# EAGLE design GrandBoard (EAGLE 6.4)
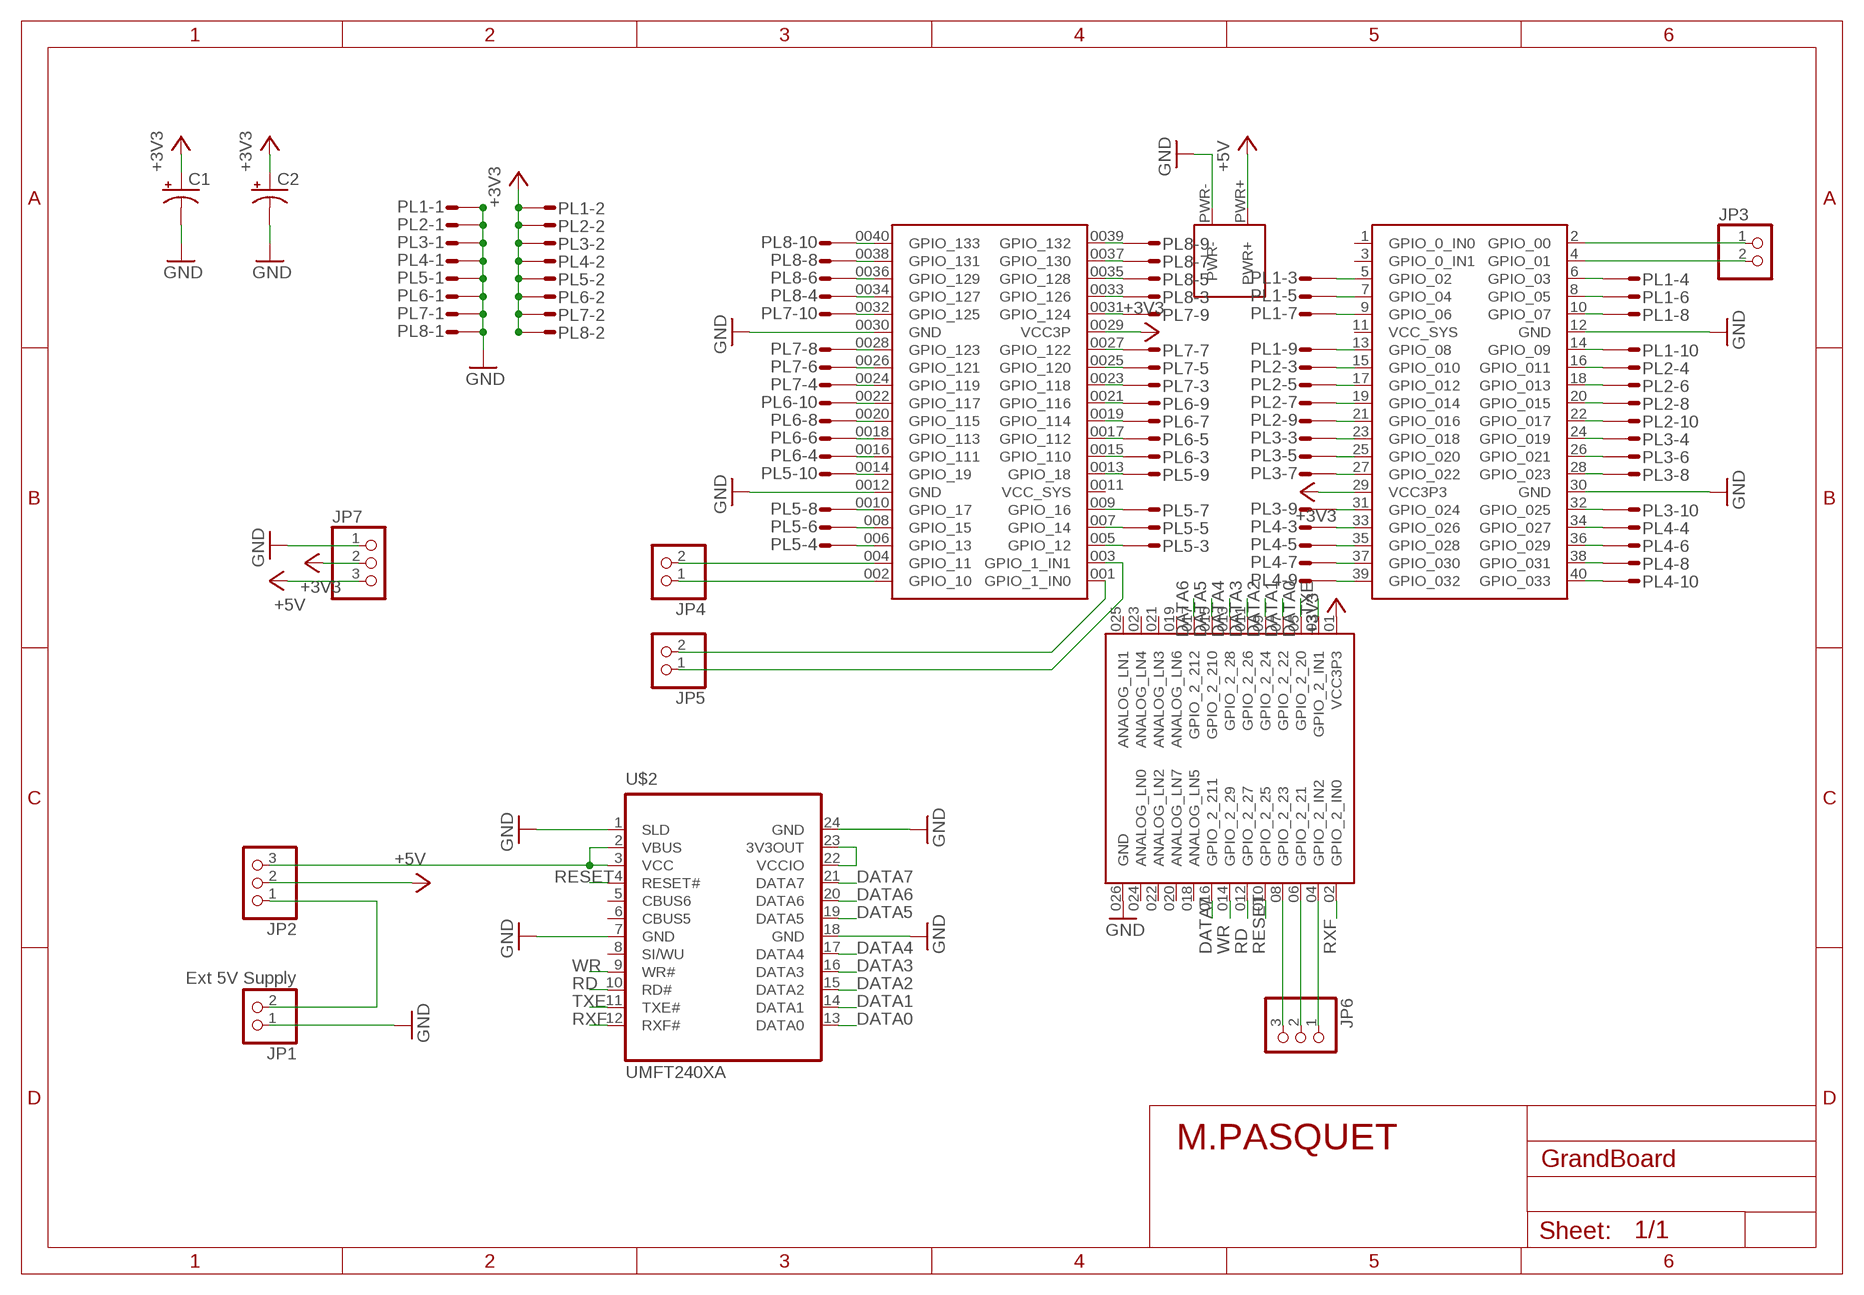
[diagram p0: schematic, sheet 1]

## Parts
C1  CAP_POLPTH2  [CPOL-RADIAL-10UF-25V]
C2  CAP_POLPTH2  [CPOL-RADIAL-10UF-25V]
JP1  Ext 5V Supply  PINHD-1X2  [1X02]
JP2  PINHD-1X3  [1X03]
JP3  PINHD-1X2  [1X02]
JP4  PINHD-1X2  [1X02]
JP5  PINHD-1X2  [1X02]
JP6  PINHD-1X3  [1X03]
JP7  PINHD-1X3  [1X03]
PL1  10HS  [10H]
PL2  10HS  [10H]
PL3  10HS  [10H]
PL4  10HS  [10H]
PL5  10HS  [10H]
PL6  10HS  [10H]
PL7  10HS  [10H]
PL8  10HS  [10H]
U$1  DE0-NANO  [DE0-NANO]
U$2  UMFT240XA  [UMFT240XA]

## Nets
+3V3: C1.1(+) C2.1(+) JP7.2 PL1.2 PL2.2 PL3.2 PL4.2 PL5.2 PL6.2 PL7.2 PL8.2 U$1.01(VCC3P3) U$1.29(VCC3P3) U$1.0029(VCC3P)
+5V: JP2.2 JP7.3 U$1.PWR+
DATA0: U$1.05(GPIO_2_20) U$2.13(DATA0)
DATA1: U$1.07(GPIO_2_22) U$2.14(DATA1)
DATA2: U$1.09(GPIO_2_24) U$2.15(DATA2)
DATA3: U$1.011(GPIO_2_26) U$2.16(DATA3)
DATA4: U$1.013(GPIO_2_28) U$2.17(DATA4)
DATA5: U$1.015(GPIO_2_210) U$2.19(DATA5)
DATA6: U$1.017(GPIO_2_212) U$2.20(DATA6)
DATA7: U$1.016(GPIO_2_211) U$2.21(DATA7)
GND: C1.2(-) C2.2(-) JP1.1 JP7.1 PL1.1 PL2.1 PL3.1 PL4.1 PL5.1 PL6.1 PL7.1 PL8.1 U$1.0012(GND) U$1.12(GND) U$1.026(GND) U$1.30(GND) U$1.0030(GND) U$1.PWR- U$2.1(SLD) U$2.7(GND) U$2.18(GND) U$2.24(GND)
N$1: PL1.3 U$1.5(GPIO_02)
N$2: PL1.4 U$1.6(GPIO_03)
N$3: PL1.5 U$1.7(GPIO_04)
N$4: PL1.6 U$1.8(GPIO_05)
N$5: PL1.7 U$1.9(GPIO_06)
N$6: PL1.8 U$1.10(GPIO_07)
N$7: PL1.9 U$1.13(GPIO_08)
N$8: PL1.10 U$1.14(GPIO_09)
N$9: PL2.3 U$1.15(GPIO_010)
N$10: PL2.4 U$1.16(GPIO_011)
N$11: PL2.5 U$1.17(GPIO_012)
N$12: PL2.6 U$1.18(GPIO_013)
N$13: PL2.7 U$1.19(GPIO_014)
N$14: PL2.8 U$1.20(GPIO_015)
N$15: PL2.9 U$1.21(GPIO_016)
N$16: PL2.10 U$1.22(GPIO_017)
N$17: PL3.3 U$1.23(GPIO_018)
N$18: PL3.4 U$1.24(GPIO_019)
N$19: PL3.5 U$1.25(GPIO_020)
N$20: PL3.6 U$1.26(GPIO_021)
N$21: PL3.7 U$1.27(GPIO_022)
N$22: PL3.8 U$1.28(GPIO_023)
N$23: PL3.9 U$1.31(GPIO_024)
N$24: PL3.10 U$1.32(GPIO_025)
N$25: PL4.3 U$1.33(GPIO_026)
N$26: PL4.4 U$1.34(GPIO_027)
N$27: PL4.6 U$1.36(GPIO_029)
N$28: PL4.5 U$1.35(GPIO_028)
N$29: PL4.7 U$1.37(GPIO_030)
N$30: PL4.8 U$1.38(GPIO_031)
N$31: PL4.9 U$1.39(GPIO_032)
N$32: PL4.10 U$1.40(GPIO_033)
N$33: PL5.3 U$1.005(GPIO_12)
N$34: PL5.4 U$1.006(GPIO_13)
N$35: PL5.5 U$1.007(GPIO_14)
N$36: PL5.6 U$1.008(GPIO_15)
N$37: PL5.7 U$1.009(GPIO_16)
N$38: PL5.8 U$1.0010(GPIO_17)
N$39: PL5.9 U$1.0013(GPIO_18)
N$40: PL5.10 U$1.0014(GPIO_19)
N$41: PL6.3 U$1.0015(GPIO_110)
N$42: PL6.4 U$1.0016(GPIO_111)
N$43: PL6.5 U$1.0017(GPIO_112)
N$44: PL6.6 U$1.0018(GPIO_113)
N$45: PL6.7 U$1.0019(GPIO_114)
N$46: PL6.8 U$1.0020(GPIO_115)
N$47: PL6.9 U$1.0021(GPIO_116)
N$48: PL6.10 U$1.0022(GPIO_117)
N$49: PL7.3 U$1.0023(GPIO_118)
N$50: PL7.4 U$1.0024(GPIO_119)
N$51: PL7.5 U$1.0025(GPIO_120)
N$52: PL7.6 U$1.0026(GPIO_121)
N$53: PL7.7 U$1.0027(GPIO_122)
N$54: PL7.8 U$1.0028(GPIO_123)
N$55: PL7.9 U$1.0031(GPIO_124)
N$56: PL7.10 U$1.0032(GPIO_125)
N$57: PL8.3 U$1.0033(GPIO_126)
N$58: PL8.4 U$1.0034(GPIO_127)
N$59: PL8.5 U$1.0035(GPIO_128)
N$60: PL8.6 U$1.0036(GPIO_129)
N$61: PL8.7 U$1.0037(GPIO_130)
N$62: PL8.8 U$1.0038(GPIO_131)
N$63: PL8.9 U$1.0039(GPIO_132)
N$64: PL8.10 U$1.0040(GPIO_133)
N$65: U$2.22(VCCIO) U$2.23(3V3OUT)
N$66: JP2.3 U$2.2(VBUS) U$2.3(VCC)
N$67: JP1.2 JP2.1
N$68: JP3.1 U$1.2(GPIO_00)
N$69: JP3.2 U$1.4(GPIO_01)
N$70: JP4.1 U$1.002(GPIO_10)
N$71: JP4.2 U$1.004(GPIO_11)
N$72: JP5.1 U$1.003(GPIO_1_IN1)
N$73: JP5.2 U$1.001(GPIO_1_IN0)
N$74: JP6.1 U$1.04(GPIO_2_IN2)
N$75: JP6.2 U$1.06(GPIO_2_21)
N$76: JP6.3 U$1.08(GPIO_2_23)
RD: U$1.012(GPIO_2_27) U$2.10(RD#)
RESET: U$1.010(GPIO_2_25) U$2.4(RESET#)
RXF: U$1.02(GPIO_2_IN0) U$2.12(RXF#)
TXE: U$1.03(GPIO_2_IN1) U$2.11(TXE#)
WR: U$1.014(GPIO_2_29) U$2.9(WR#)
Unconnected: U$1.1(GPIO_0_IN0) U$1.3(GPIO_0_IN1) U$1.0011(VCC_SYS) U$1.11(VCC_SYS) U$1.018(ANALOG_LN5) U$1.019(ANALOG_LN6) U$1.020(ANALOG_LN7) U$1.021(ANALOG_LN3) U$1.022(ANALOG_LN2) U$1.023(ANALOG_LN4) U$1.024(ANALOG_LN0) U$1.025(ANALOG_LN1) U$2.5(CBUS6) U$2.6(CBUS5) U$2.8(SI/WU)

## Notes on the sheet
- M.PASQUET

## Library data of the parts
C1 C2 = SparkFun-Passives:CAP_POL: Capacitor Polarized These are standard SMD and PTH capacitors. Normally 10uF, 47uF, and 100uF in electrolytic and tantalum varieties. Always verify the external diameter of the through hole cap, it varies with capacity, voltage, and manufacturer. The EIA devices should be standard.
JP1 JP3-JP5 = pinhead:PINHD-1X2: PIN HEADER
JP2 JP6 JP7 = pinhead:PINHD-1X3: PIN HEADER
PL1-PL8 = con-harting-h:10HS: CONNECTOR; OC_FARNELL: unknown; OC_NEWARK: unknown
U$1 = DE0-NANO:DE0-NANO
U$2 = DE0-NANO:UMFT240XA

## Board
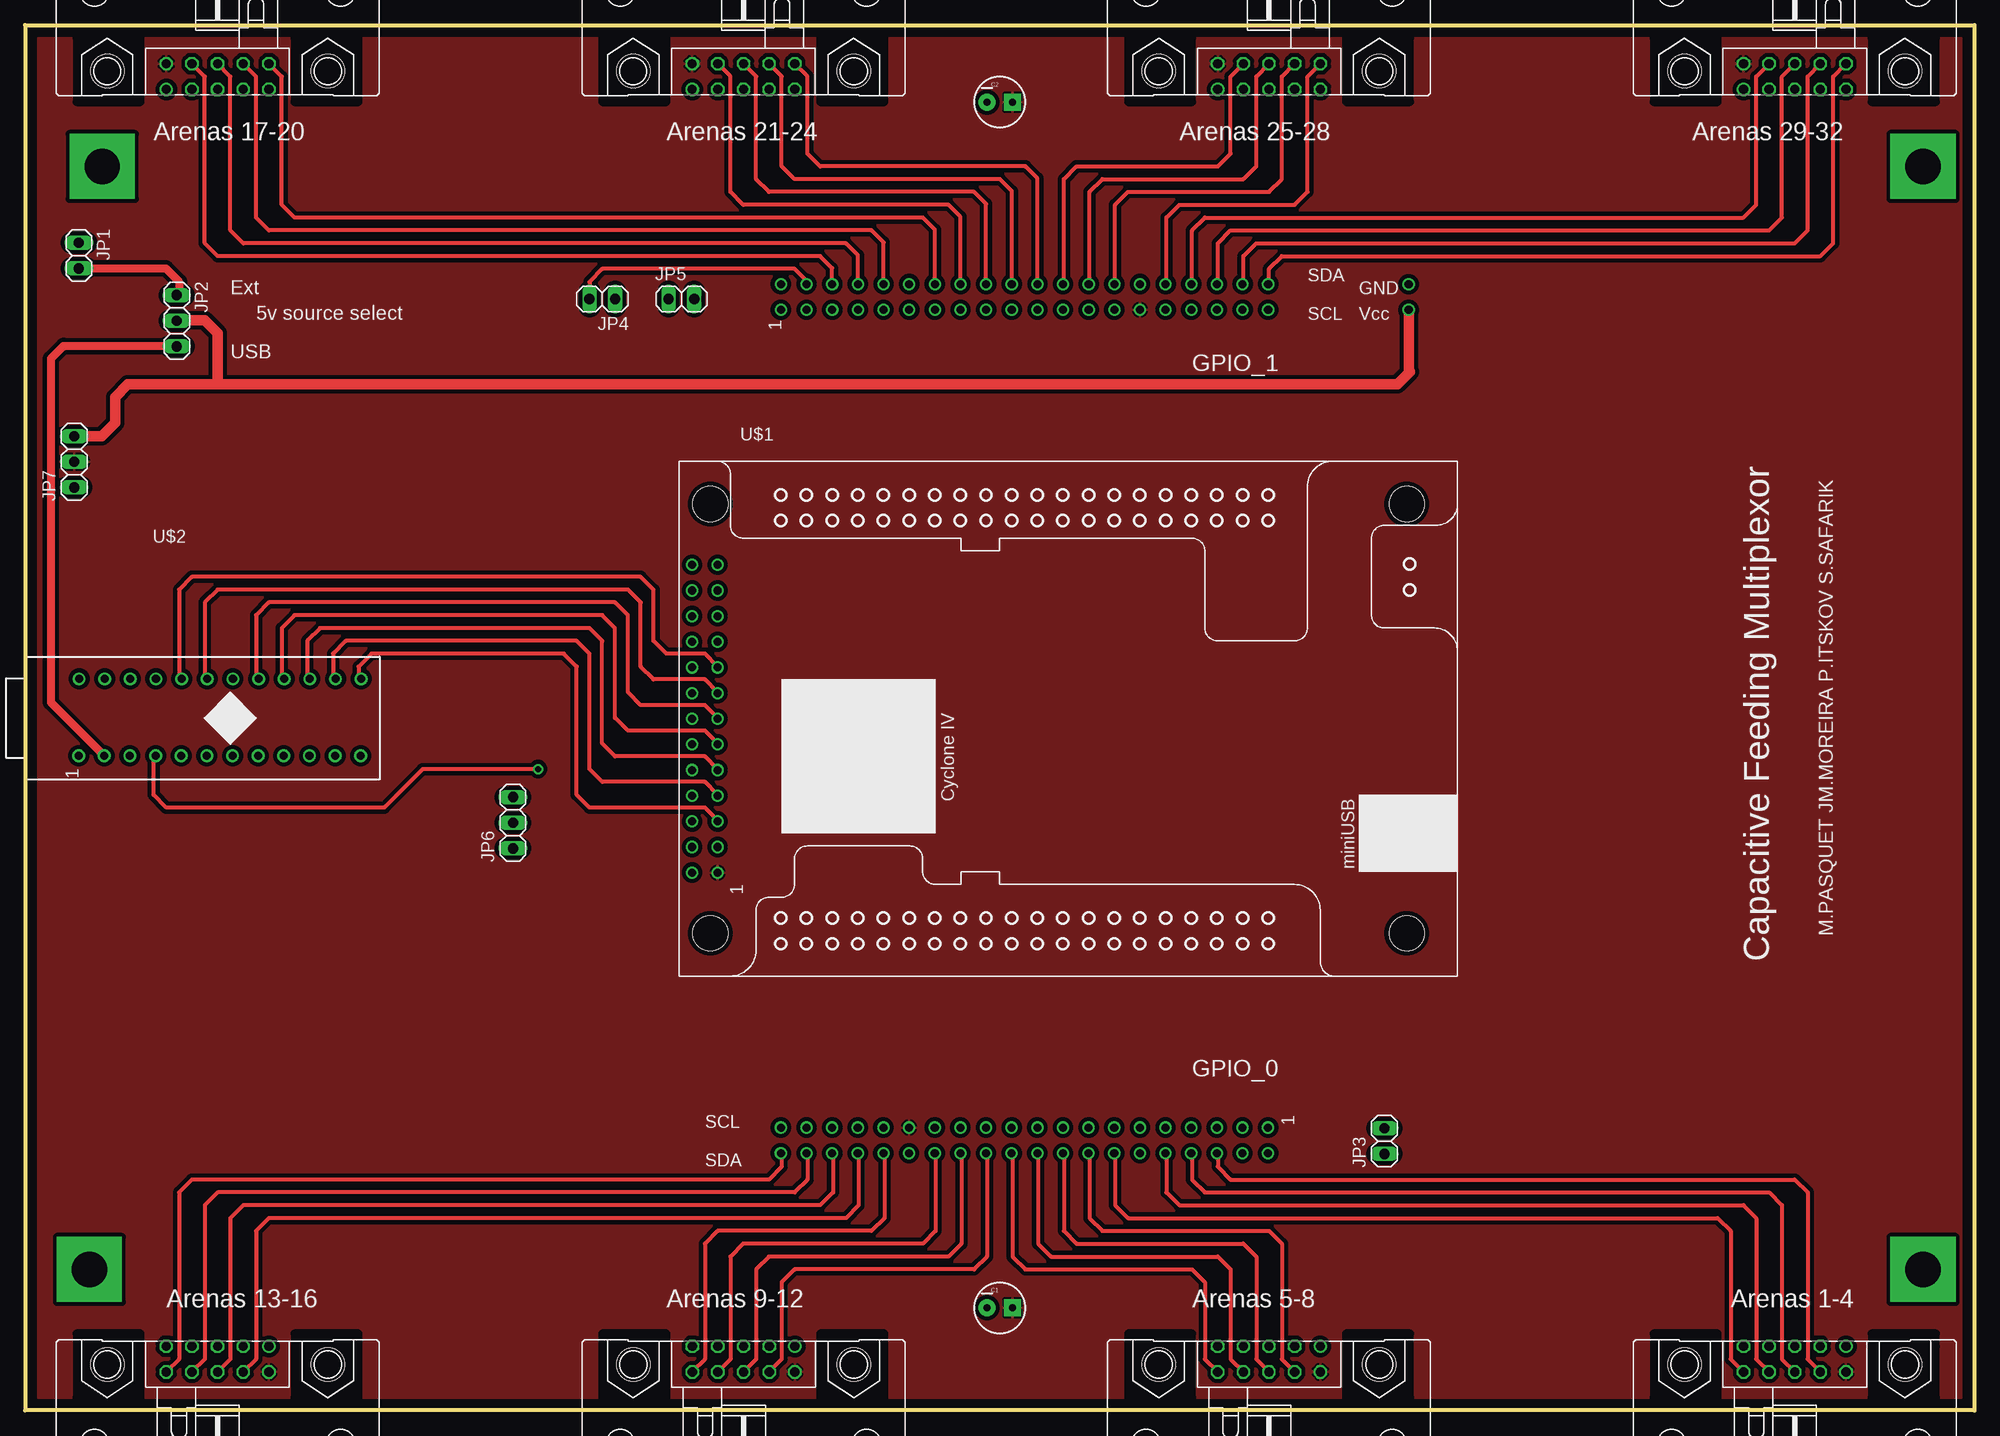
[diagram p1: board, top side]
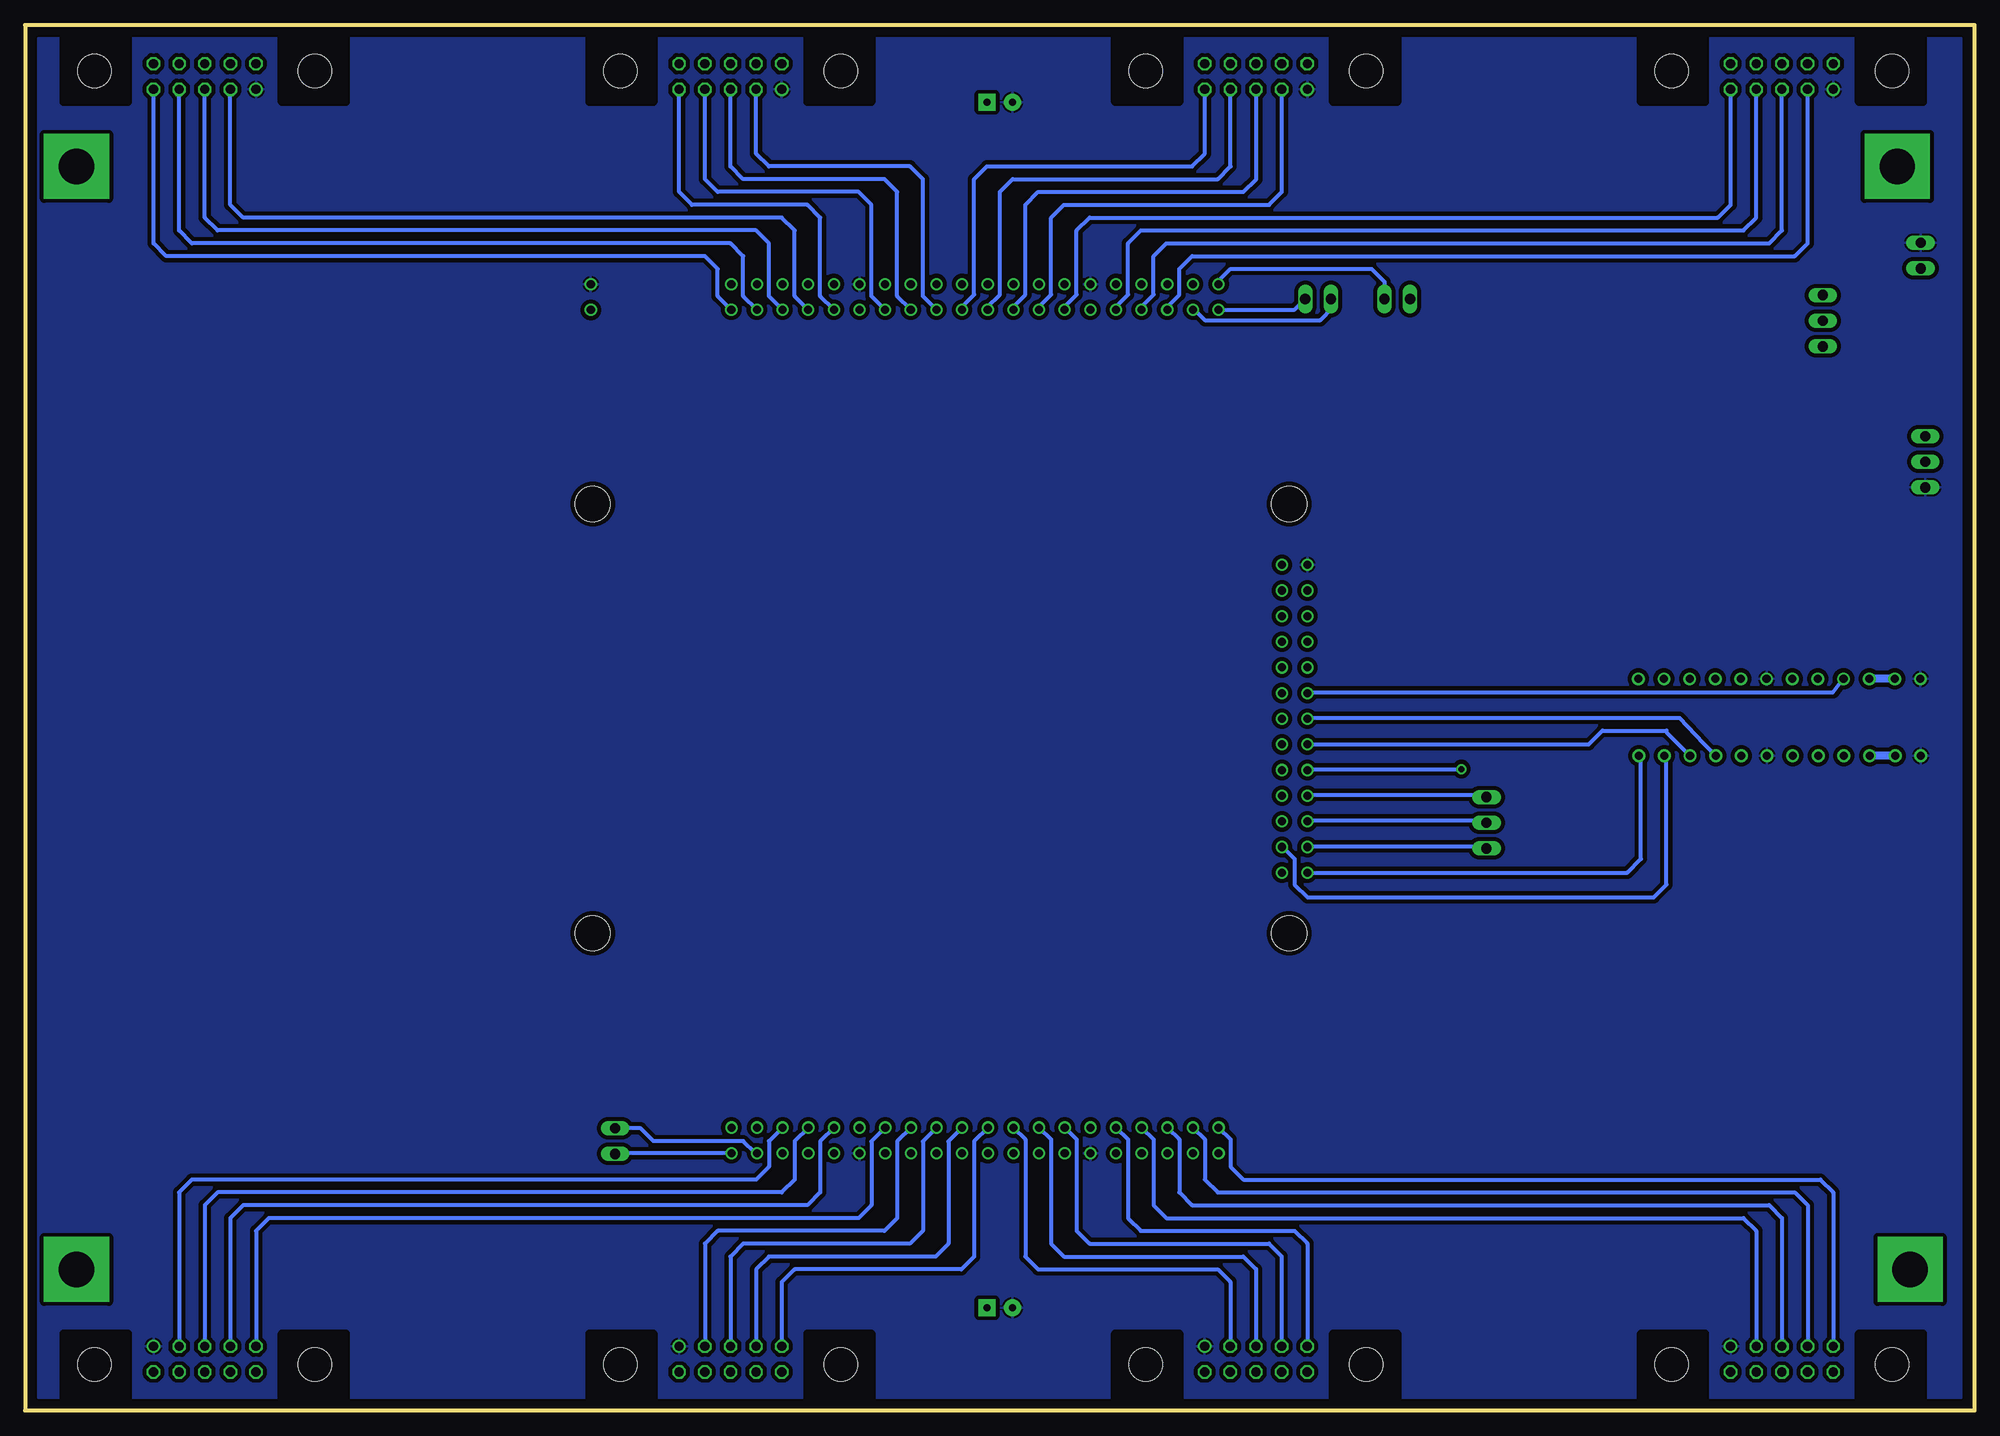
[diagram p2: board, bottom side, seen from below]

Size 193.04 x 137.16 mm. Coordinates in mm from the lower left corner, seen from the top.
Outline: 0,137.16 0,0 193.04,0 193.04,137.16 0,137.16
Copper layers (1*16): Top 0.018mm / dielectric 1.55mm / Bottom 0.018mm
Design rules "default": minimum track width 0.15mm, minimum drill 0.25mm, track to track 0.15mm, track to pad 0.15mm, pad to pad 0.15mm, via to via 0.15mm, smd to smd 0.15mm, copper to edge 0.45mm, drill to drill 0.3mm, minimum pad ring 0.2mm, minimum via ring 0.2mm, stop-mask expansion 0.1mm, vias tented up to drill 0mil, thermal gap 0.2mm
tRestrict: area 5.1,129.5 to 11.4,135.9; area 26.7,129.5 to 33,135.9; area 57.2,129.5 to 63.5,135.9; area 78.7,129.5 to 85.1,135.9; area 109.2,129.5 to 115.6,135.9; area 130.8,129.5 to 137.2,135.9; area 161.3,129.5 to 167.6,135.9; area 182.9,129.5 to 189.2,135.9; area 182.9,1.3 to 189.2,6.3; area 182.9,6.3 to 189.2,7.6; area 130.8,1.3 to 137.2,7.6; area 109.2,1.3 to 115.6,7.6; 5 more areas
bRestrict: area 5.1,1.3 to 11.4,7.6; area 26.7,1.3 to 33,7.6; area 57.2,1.3 to 63.5,7.6; area 78.7,1.3 to 85.1,7.6; area 109.2,1.3 to 115.6,7.6; area 130.8,1.3 to 137.2,7.6; area 161.3,1.3 to 167.6,7.6; area 182.9,1.3 to 189.2,7.6; area 109.2,129.5 to 115.6,135.9; area 130.8,129.5 to 137.2,135.9; area 161.3,129.5 to 167.6,135.9; area 182.9,129.5 to 189.2,135.9; 4 more areas

### Footprints (pad centres in the part's own frame; a part is rotated, then mirrored left to right if it is on the bottom)
CPOL-RADIAL-10UF-25V = drill 0.7 pad 1.651 square: 1 1.27,0 | drill 0.7 pad 1.651: 2 -1.27,0
1X02 = drill 1.016 long: 1 -1.27,0; 2 1.27,0
1X03 = drill 1.016 long: 1 -2.54,0; 2 0,0; 3 2.54,0
10H = drill 0.914: 1 -5.08,-1.27 | drill 0.914 octagon: 2 -5.08,1.27; 3 -2.54,-1.27; 4 -2.54,1.27; 5 0,-1.27; 6 0,1.27; 7 2.54,-1.27; 8 2.54,1.27; 9 5.08,-1.27; 10 5.08,1.27 | hole 3.302: -10.922,0.533; 10.922,0.533
DE0-NANO = drill 0.8: 01 40.73,3.81; 001 -15.01,10.08; 1 65.97,58.33; 02 40.73,1.27; 002 -17.55,10.08; 2 68.51,58.33; 03 38.19,3.81; 003 -15.01,12.62; 3 65.97,55.79; 04 38.19,1.27; 004 -17.55,12.62; 4 68.51,55.79; 05 35.65,3.81; 005 -15.01,15.16; 5 65.97,53.25; 06 35.65,1.27; 006 -17.55,15.16; 6 68.51,53.25; 07 33.11,3.81; 007 -15.01,17.7; 7 65.97,50.71; 08 33.11,1.27; 008 -17.55,17.7; 8 68.51,50.71; 09 30.57,3.81; 009 -15.01,20.24; 9 65.97,48.17; 010 30.57,1.27; 0010 -17.55,20.24; 10 68.51,48.17; 011 28.03,3.81; 0011 -15.01,22.78; 11 65.97,45.63; 012 28.03,1.27; 0012 -17.55,22.78; 12 68.51,45.63; 013 25.49,3.81; 0013 -15.01,25.32; 13 65.97,43.09; 014 25.49,1.27; 0014 -17.55,25.32; 14 68.51,43.09; 015 22.95,3.81; 0015 -15.01,27.86; 15 65.97,40.55; 016 22.95,1.27; 0016 -17.55,27.86; 16 68.51,40.55; 017 20.41,3.81; 0017 -15.01,30.4; 17 65.97,38.01; 018 20.41,1.27; 0018 -17.55,30.4; 18 68.51,38.01; 019 17.87,3.81; 0019 -15.01,32.94; 19 65.97,35.47; 020 17.87,1.27; 0020 -17.55,32.94; 20 68.51,35.47; 021 15.33,3.81; 0021 -15.01,35.48; 21 65.97,32.93; 022 15.33,1.27; 0022 -17.55,35.48; 22 68.51,32.93; 023 12.79,3.81; 0023 -15.01,38.02; 23 65.97,30.39; 024 12.79,1.27; 0024 -17.55,38.02; 24 68.51,30.39; 025 10.25,3.81; 0025 -15.01,40.56; 25 65.97,27.85; 026 10.25,1.27; 0026 -17.55,40.56; 26 68.51,27.85; 0027 -15.01,43.1; 27 65.97,25.31; 0028 -17.55,43.1; 28 68.51,25.31; 0029 -15.01,45.64; 29 65.97,22.77; 0030 -17.55,45.64; 30 68.51,22.77; 0031 -15.01,48.18; 31 65.97,20.23; 0032 -17.55,48.18; 32 68.51,20.23; 0033 -15.01,50.72; 33 65.97,17.69; 0034 -17.55,50.72; 34 68.51,17.69; 0035 -15.01,53.26; 35 65.97,15.15; 0036 -17.55,53.26; 36 68.51,15.15; 0037 -15.01,55.8; 37 65.97,12.61; 0038 -17.55,55.8; 38 68.51,12.61; 0039 -15.01,58.34; 39 65.97,10.07; 0040 -17.55,58.34; 40 68.51,10.07; PWR+ -15,72.25; PWR- -17.54,72.25 | hole 3.5: 46.73,3.07; 4.23,3.07; 4.23,72.07; 46.73,72.07
UMFT240XA = drill 0.8 pad 1.27: 1 7.611,-0.02; 2 7.611,2.52; 3 7.611,5.06; 4 7.611,7.6; 5 7.611,10.14; 6 7.611,12.68; 7 7.611,15.22; 8 7.611,17.76; 9 7.611,20.3; 10 7.611,22.84; 11 7.611,25.38; 12 7.611,27.92; 13 0.01,27.96; 14 0.01,25.42; 15 0.01,22.88; 16 0.01,20.34; 17 0.01,17.8; 18 0.01,15.26; 19 0.01,12.72; 20 0.01,10.18; 21 0.01,7.64; 22 0.01,5.1; 23 0.01,2.56; 24 0.01,0.02

### Placement (x,y rotation side)
C1  96.52,10.16 0 top
C2  96.52,129.54 0 top
JP1  5.31,114.35 270 top
JP2  15.01,107.9 270 top
JP3  134.62,26.67 90 top
JP4  57.15,110.05 180 top
JP5  65,110.05 0 top
JP6  48.31,58.19 90 top
JP7  4.85,93.93 90 top
PL1  175.26,5.08 180 top
PL2  123.19,5.08 180 top
PL3  71.15,5.08 180 top
PL4  19.05,5.08 180 top
PL5  19.05,132.08 0 top
PL6  71.14,132.08 0 top
PL7  123.19,132.08 0 top
PL8  175.26,132.08 0 top
U$1  64.77,93.98 270 top
U$2  5.31,72.44 270 top

### Tracks (layer width: path | path; a pad name or v marks a point on that pad's centre or on a via)
+3V3
  pour Top (isolate 0.406): 1.27,135.89 191.77,135.89 191.77,1.27 1.27,1.27
+5V
  Top 1.016: JP7.3 7.57,96.47 8.89,97.79 8.89,100.33 10.16,101.6 19.05,101.6 | 19.05,101.6 19.05,106.68 17.78,107.95 15.06,107.95 JP2.2 | U$1.PWR+ 137.02,103.01 137.16,102.87 135.89,101.6 19.05,101.6
DATA0
  Top 0.406: U$1.05 68.58,58.42 67.31,59.69 55.88,59.69 54.61,60.96 54.61,73.66 53.34,74.93 34.29,74.93 33.02,73.66 33.02,72.68 U$2.13
DATA1
  Top 0.406: U$1.07 68.58,60.96 67.31,62.23 57.15,62.23 55.88,63.5 55.88,74.93 54.61,76.2 31.75,76.2 30.48,74.93 30.48,72.68 U$2.14
DATA2
  Top 0.406: U$1.09 68.58,63.5 67.31,64.77 58.42,64.77 57.15,66.04 57.15,76.2 55.88,77.47 29.21,77.47 27.94,76.2 27.94,72.68 U$2.15
DATA3
  Top 0.406: U$1.011 68.58,66.04 67.31,67.31 59.69,67.31 58.42,68.58 58.42,77.47 57.15,78.74 26.67,78.74 25.4,77.47 25.4,72.68 U$2.16
DATA4
  Top 0.406: U$1.013 68.58,68.58 67.31,69.85 60.96,69.85 59.69,71.12 59.69,78.74 58.42,80.01 24.13,80.01 22.86,78.74 22.86,72.68 U$2.17
DATA5
  Top 0.406: U$1.015 68.58,71.12 67.31,72.39 62.23,72.39 60.96,73.66 60.96,80.01 59.69,81.28 19.05,81.28 17.78,80.01 17.78,72.68 U$2.19
DATA6
  Top 0.406: U$1.017 68.58,73.66 67.31,74.93 63.5,74.93 62.23,76.2 62.23,81.28 60.96,82.55 16.51,82.55 15.24,81.28 15.24,72.68 U$2.20
DATA7
  Bottom 0.406: U$1.016 66.04,71.12 13.97,71.12 U$2.21
GND
  pour Bottom (isolate 0.406): 1.27,135.89 191.77,135.89 191.77,1.27 1.27,1.27
N$1
  Bottom 0.406: U$1.5 119.36,26.67 119.38,26.67 119.38,24.13 120.65,22.86 176.53,22.86 177.8,21.59 PL1.3
N$2
  Top 0.406: U$1.6 118.11,25.38 118.11,24.13 119.38,22.86 175.26,22.86 176.53,21.59 176.53,5.08 PL1.4
N$3
  Bottom 0.406: U$1.7 116.82,26.67 116.84,26.67 116.84,22.86 118.11,21.59 173.99,21.59 175.26,20.32 PL1.5
N$4
  Top 0.406: U$1.8 115.57,25.38 115.57,22.86 116.84,21.59 172.72,21.59 173.99,20.32 173.99,5.08 PL1.6
N$5
  Bottom 0.406: U$1.9 114.3,26.65 114.3,21.59 115.57,20.32 171.45,20.32 172.72,19.05 PL1.7
N$6
  Top 0.406: U$1.10 113.03,25.38 113.03,21.59 114.3,20.32 170.18,20.32 171.45,19.05 171.45,5.08 PL1.8
N$7
  Bottom 0.406: PL1.9 170.18,17.78 168.91,19.05 110.49,19.05 109.22,20.32 109.22,26.65 U$1.13
N$8
  Top 0.406: U$1.14 107.95,25.38 107.95,20.32 109.22,19.05 167.64,19.05 168.91,17.78 168.91,5.08 PL1.10
N$9
  Bottom 0.406: U$1.15 106.68,26.65 106.68,19.05 107.95,17.78 124.46,17.78 125.73,16.51 PL2.3
N$10
  Top 0.406: U$1.16 105.41,25.38 105.41,19.05 106.68,17.78 123.19,17.78 124.46,16.51 124.46,5.08 PL2.4
N$11
  Bottom 0.406: U$1.17 104.14,26.65 104.14,17.78 105.41,16.51 121.92,16.51 123.19,15.24 PL2.5
N$12
  Top 0.406: U$1.18 102.87,25.38 102.87,17.78 104.14,16.51 120.65,16.51 121.92,15.24 121.92,5.08 PL2.6
N$13
  Bottom 0.406: U$1.19 101.6,26.65 101.6,16.51 102.87,15.24 119.38,15.24 120.65,13.97 PL2.7
N$14
  Top 0.406: U$1.20 100.33,25.38 100.33,16.51 101.6,15.24 118.11,15.24 119.38,13.97 119.38,5.08 PL2.8
N$15
  Bottom 0.406: U$1.21 99.06,26.65 99.06,15.24 100.33,13.97 116.84,13.97 118.11,12.7 PL2.9
N$16
  Top 0.406: U$1.22 97.79,25.38 97.79,15.24 99.06,13.97 115.57,13.97 116.84,12.7 116.84,5.08 PL2.10
N$17
  Bottom 0.406: U$1.23 93.98,26.83 93.98,15.24 92.71,13.97 74.93,13.97 73.69,12.72 PL3.3
N$18
  Top 0.406: U$1.24 95.25,25.38 95.25,15.24 93.98,13.97 76.2,13.97 74.93,12.7 74.93,5.08 73.69,3.83 PL3.4
N$19
  Bottom 0.406: U$1.25 91.44,26.83 91.44,16.51 90.17,15.24 72.39,15.24 71.14,13.99 PL3.5
N$20
  Top 0.406: U$1.26 92.71,25.38 92.71,16.51 91.44,15.24 73.66,15.24 72.39,13.97 72.39,5.08 71.14,3.83 PL3.6
N$21
  Bottom 0.406: U$1.27 88.9,26.83 88.9,17.78 87.63,16.51 69.85,16.51 68.61,15.27 PL3.7
N$22
  Top 0.406: U$1.28 90.17,25.38 90.17,17.78 88.9,16.51 71.12,16.51 69.85,15.24 69.85,5.08 68.61,3.83 PL3.8
N$23
  Bottom 0.406: U$1.31 83.82,26.83 83.82,19.05 82.55,17.78 67.31,17.78 66.06,16.54 PL3.9
N$24
  Top 0.406: U$1.32 85.09,25.38 85.09,19.05 83.82,17.78 68.58,17.78 67.31,16.51 67.31,5.08 66.06,3.83 PL3.10
N$25
  Bottom 0.406: U$1.33 81.28,26.83 81.28,20.32 80.01,19.05 22.86,19.05 21.59,17.78 PL4.3
N$26
  Top 0.406: U$1.34 82.55,25.38 82.55,20.32 81.28,19.05 24.13,19.05 22.86,17.78 22.86,5.08 PL4.4
N$27
  Top 0.406: U$1.36 80.01,25.38 80.01,21.59 78.74,20.32 21.59,20.32 20.32,19.05 20.32,5.08 PL4.6
N$28
  Bottom 0.406: U$1.35 78.74,26.83 78.74,21.59 77.47,20.32 20.32,20.32 19.05,19.05 PL4.5
N$29
  Bottom 0.406: U$1.37 76.2,26.83 76.2,22.86 74.93,21.59 17.78,21.59 16.51,20.32 PL4.7
N$30
  Top 0.406: U$1.38 77.47,25.38 77.47,22.86 76.2,21.59 19.05,21.59 17.78,20.32 17.78,5.08 PL4.8
N$31
  Bottom 0.406: U$1.39 73.66,26.83 73.66,24.13 72.39,22.86 15.24,22.86 13.97,21.59 PL4.9
N$32
  Top 0.406: U$1.40 74.93,25.38 74.93,24.13 73.66,22.86 16.51,22.86 15.24,21.59 15.24,5.08 PL4.10
N$33
  Bottom 0.406: U$1.005 79.93,109.3 78.74,110.49 78.74,113.03 77.47,114.3 17.78,114.3 16.51,115.57 PL5.3
N$34
  Top 0.406: U$1.006 79.93,113.11 78.74,114.3 19.05,114.3 17.78,115.57 17.78,132.08 PL5.4
N$35
  Bottom 0.406: U$1.007 82.47,109.3 81.28,110.49 81.28,114.3 80.01,115.57 20.32,115.57 19.05,116.84 PL5.5
N$36
  Top 0.406: U$1.008 82.47,114.38 81.28,115.57 21.59,115.57 20.32,116.84 20.32,132.08 PL5.6
N$37
  Bottom 0.406: U$1.009 85.01,109.3 83.82,110.49 83.82,115.57 82.55,116.84 22.86,116.84 21.59,118.11 PL5.7
N$38
  Top 0.406: U$1.0010 85.01,115.65 83.82,116.84 24.13,116.84 22.86,118.11 22.86,132.08 PL5.8
N$39
  Bottom 0.406: U$1.0013 90.09,109.3 88.9,110.49 88.9,116.84 87.63,118.11 25.4,118.11 24.13,119.38 PL5.9
N$40
  Top 0.406: U$1.0014 90.09,116.92 88.9,118.11 26.67,118.11 25.4,119.38 25.4,132.08 PL5.10
N$41
  Bottom 0.406: U$1.0015 92.63,109.3 91.44,110.49 91.44,118.11 90.17,119.38 69.85,119.38 68.58,120.65 68.58,130.79 PL6.3
N$42
  Top 0.406: U$1.0016 92.63,118.19 91.44,119.38 71.12,119.38 69.85,120.65 69.85,132.1 PL6.4
N$43
  Bottom 0.406: U$1.0017 95.17,109.3 93.98,110.49 93.98,119.38 92.71,120.65 72.39,120.65 71.12,121.92 71.12,130.79 PL6.5
N$44
  Top 0.406: U$1.0018 95.17,119.46 93.98,120.65 73.66,120.65 72.39,121.92 72.39,132.1 PL6.6
N$45
  Bottom 0.406: U$1.0019 97.71,109.3 96.52,110.49 96.52,120.65 95.25,121.92 74.93,121.92 73.66,123.19 73.66,130.79 PL6.7
N$46
  Top 0.406: U$1.0020 97.71,120.73 96.52,121.92 76.2,121.92 74.93,123.19 74.93,132.1 PL6.8
N$47
  Bottom 0.406: U$1.0021 100.25,109.3 99.06,110.49 99.06,121.92 97.79,123.19 77.47,123.19 76.2,124.46 76.2,130.79 PL6.9
N$48
  Top 0.406: U$1.0022 100.25,122 99.06,123.19 78.74,123.19 77.47,124.46 77.47,132.1 PL6.10
N$49
  Bottom 0.406: U$1.0023 104.14,110.34 104.14,121.92 105.41,123.19 119.38,123.19 120.65,124.46 PL7.3
N$50
  Top 0.406: U$1.0024 102.87,111.61 102.87,121.92 104.14,123.19 118.11,123.19 119.38,124.46 119.38,132.08 PL7.4
N$51
  Bottom 0.406: U$1.0025 106.68,110.34 106.68,120.65 107.95,121.92 121.92,121.92 123.19,123.19 PL7.5
N$52
  Top 0.406: U$1.0026 105.41,111.61 105.41,120.65 106.68,121.92 120.65,121.92 121.92,123.19 121.92,132.08 PL7.6
N$53
  Bottom 0.406: U$1.0027 109.22,110.34 109.22,119.38 110.49,120.65 124.46,120.65 125.73,121.92 PL7.7
N$54
  Top 0.406: U$1.0028 107.95,111.61 107.95,119.38 109.22,120.65 123.19,120.65 124.46,121.92 124.46,132.08 PL7.8
N$55
  Bottom 0.406: U$1.0031 114.3,110.34 114.3,118.11 115.57,119.38 127,119.38 128.27,120.65 PL7.9
N$56
  Top 0.406: U$1.0032 113.03,111.61 113.03,118.11 114.3,119.38 125.73,119.38 127,120.65 127,132.08 PL7.10
N$57
  Bottom 0.406: U$1.0033 116.84,110.34 116.84,116.84 118.11,118.11 171.45,118.11 172.72,119.38 PL8.3
N$58
  Top 0.406: U$1.0034 115.57,111.61 115.57,116.84 116.84,118.11 170.18,118.11 171.45,119.38 171.45,132.08 PL8.4
N$59
  Bottom 0.406: U$1.0035 119.38,110.34 119.38,115.57 120.65,116.84 173.99,116.84 175.26,118.11 PL8.5
N$60
  Top 0.406: U$1.0036 118.11,111.61 118.11,115.57 119.38,116.84 172.72,116.84 173.99,118.11 173.99,132.08 PL8.6
N$61
  Bottom 0.406: U$1.0037 121.92,110.34 121.92,114.3 123.19,115.57 176.53,115.57 177.8,116.84 PL8.7
N$62
  Top 0.406: U$1.0038 120.65,111.61 120.65,114.3 121.92,115.57 175.26,115.57 176.53,116.84 176.53,132.08 PL8.8
N$63
  Bottom 0.406: U$1.0039 124.46,110.34 124.46,113.03 125.73,114.3 179.07,114.3 180.34,115.57 PL8.9
N$64
  Top 0.406: U$1.0040 123.19,111.61 123.19,113.03 124.46,114.3 177.8,114.3 179.07,115.57 179.07,132.08 PL8.10
N$65
  Bottom 0.813: U$2.23 U$2.22
N$66
  Top 0.813: JP2.3 3.86,105.36 3.81,105.41 2.54,104.14 2.54,70.12 U$2.2
  Bottom 0.813: U$2.2 U$2.3
N$67
  Top 0.813: JP1.2 13.92,113.08 15.24,111.76 15.24,110.67 JP2.1
N$68
  Bottom 0.406: U$1.2 134.55,25.47 JP3.1
N$69
  Bottom 0.406: U$1.4 120.72,25.47 121.92,26.67 130.81,26.67 132.08,27.94 JP3.2
N$70
  Bottom 0.406: U$1.002 74.85,111.84 73.66,113.03 59.69,113.03 58.42,111.76 JP4.1
N$71
  Top 0.406: U$1.004 77.39,111.84 76.2,113.03 57.15,113.03 55.88,111.76 JP4.2
N$72
  Bottom 0.406: U$1.003 77.39,109.14 | 77.39,109.14 77.47,109.22 | 77.39,109.14 76.2,107.95 64.77,107.95 63.5,109.22 63.5,109.82 JP5.1
N$73
  Bottom 0.406: U$1.001 67.33,108.99 JP5.2
N$74
  Bottom 0.406: U$1.04 66.04,55.88 48.26,55.88 48.31,55.83 JP6.1
N$75
  Bottom 0.406: U$1.06 66.04,58.42 48.26,58.42 48.31,58.37 JP6.2
N$76
  Bottom 0.406: U$1.08 66.04,60.96 48.26,60.96 48.31,60.91 JP6.3
N$77  (via drill 3.5 pad 6.45)
  other vias: 187.96,123.19
N$78  (via drill 3.5 pad 6.45)
  other vias: 187.96,13.97
N$79  (via drill 3.5 pad 6.45)
  other vias: 6.35,13.97
N$80  (via drill 3.5 pad 6.45)
  other vias: 7.62,123.19
RD
  Bottom 0.406: U$1.012 38.19,65.95 36.83,67.31 30.48,67.31 30.48,67.16 U$2.10
RESET  (via drill 0.6)
  Top 0.406: v50.8,63.5 39.37,63.5 35.56,59.69 13.97,59.69 12.7,60.96 12.7,64.77 U$2.4
  Bottom 0.406: U$1.010 66.04,63.5 v50.8,63.5
RXF
  Bottom 0.406: U$1.02 34.38,53.25 33.02,54.61 33.02,64.77 U$2.12
TXE
  Bottom 0.406: U$1.03 68.49,55.79 67.31,54.61 67.31,52.07 66.04,50.8 31.75,50.8 30.48,52.07 30.48,64.62 U$2.11
WR
  Bottom 0.406: U$1.014 66.04,68.58 29.21,68.58 26.82,66.04 U$2.9

### Text on the board
tPlace: Arenas 17-20 | Arenas 21-24 | Arenas 25-28 | Arenas 29-32 | SDA | Ext | 5v source select | SCL | USB | GPIO_1 | M.PASQUET JM.MOREIRA P.ITSKOV S.SAFARIK | Capacitive Feeding Multiplexor | GPIO_0 | SCL | SDA | Arenas 13-16 | Arenas 9-12 | Arenas 5-8 | Arenas 1-4